# EAGLE design io_board (EAGLE 7.1.0)
Assembly variants: 3.3V monochrome, 5V monochrome, 3.3V RGB, 5V RGB

## Sheet 1 of 2
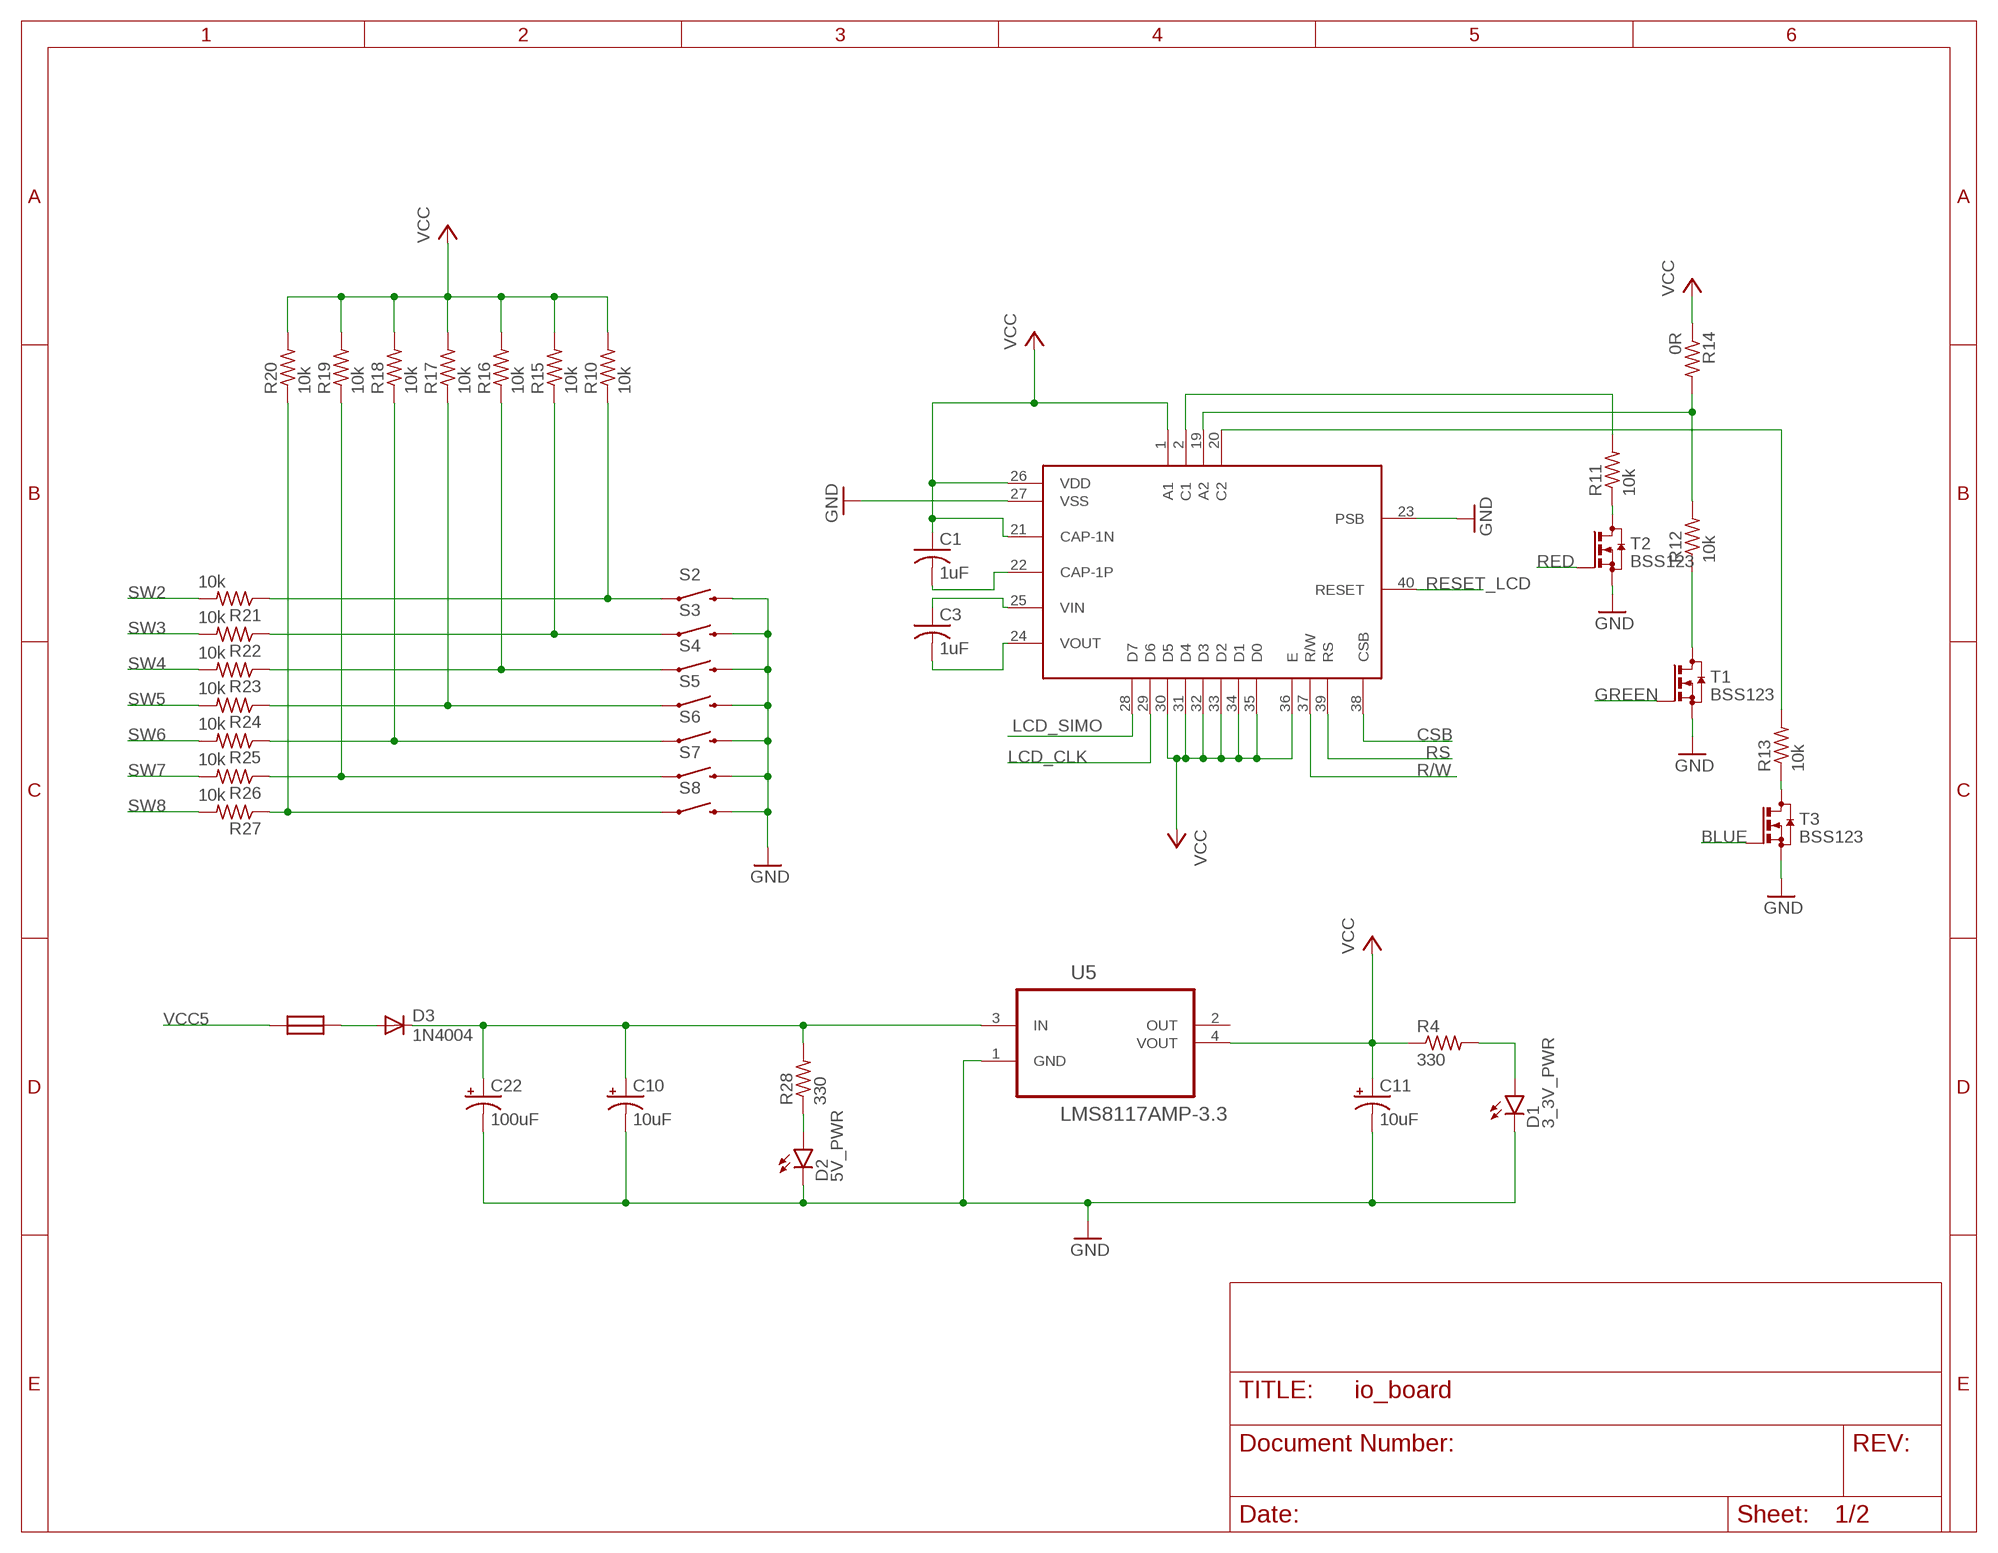
[diagram p0: schematic, sheet 1]

### Parts
C1  1uF  C-USC1206K  [C1206K]
C3  1uF  C-USC1206K  [C1206K]
C10  10uF  10UF-16V-10%(TANT)  [EIA3216]
C11  10uF  10UF-16V-10%(TANT)  [EIA3216]
C22  100uF  100UF-10V-10%(TANT)  [EIA7343]
D1  3_3V_PWR  LED-FKIT-1206  [FKIT-LED-1206]
D2  5V_PWR  LED-FKIT-1206  [FKIT-LED-1206]
D3  1N4004  [DO41-10]
R4  330  R-US_R0805W  [R0805W]
R10  10k  R-US_R1206W  [R1206W]
R11  10k  R-US_R1206W  [R1206W]
R12  10k  R-US_R1206W  [R1206W]  (not fitted in variant 3.3V monochrome)  (not fitted in variant 5V monochrome)
R13  10k  R-US_R1206W  [R1206W]
R14  0R  R-US_R1206W  [R1206W]  (not fitted in variant 3.3V RGB)  (not fitted in variant 5V RGB)
R15  10k  R-US_R1206W  [R1206W]
R16  10k  R-US_R1206W  [R1206W]
R17  10k  R-US_R1206W  [R1206W]
R18  10k  R-US_R1206W  [R1206W]
R19  10k  R-US_R1206W  [R1206W]
R20  10k  R-US_R1206W  [R1206W]
R21  10k  R-US_R1206W  [R1206W]
R22  10k  R-US_R1206W  [R1206W]
R23  10k  R-US_R1206W  [R1206W]
R24  10k  R-US_R1206W  [R1206W]
R25  10k  R-US_R1206W  [R1206W]
R26  10k  R-US_R1206W  [R1206W]
R27  10k  R-US_R1206W  [R1206W]
R28  330  R-US_R0805W  [R0805W]
S2  SWITCH-MOMENTARY-2SMD-4  [TACTILE_SWITCH_TALL]
S3  SWITCH-MOMENTARY-2SMD-4  [TACTILE_SWITCH_TALL]
S4  SWITCH-MOMENTARY-2SMD-4  [TACTILE_SWITCH_TALL]
S5  SWITCH-MOMENTARY-2SMD-4  [TACTILE_SWITCH_TALL]
S6  SWITCH-MOMENTARY-2SMD-4  [TACTILE_SWITCH_TALL]
S7  SWITCH-MOMENTARY-2SMD-4  [TACTILE_SWITCH_TALL]
S8  SWITCH-MOMENTARY-2SMD-4  [TACTILE_SWITCH_TALL]
T1  BSS123  [SOT23]
T2  BSS123  [SOT23]
T3  BSS123  [SOT23]
U5  LMS8117AMP-3.3  [SOT230P696X180-4N]
U$2  EA_DOGMXXX-A  [EADOGM]
U$3  NANO_FUSE  [NANO_FUSE]

### Nets
BLUE: T3.1(G) ; also sheet 2
CSB: U$2.38(CSB) ; also sheet 2
GND: C10.C(-) C11.C(-) C22.C(-) D1.C D2.C S2.B2 S3.B2 S4.B2 S5.B2 S6.B2 S7.B2 S8.B2 T1.2(S) T2.2(S) T3.2(S) U5.1(GND) U$2.23(PSB) U$2.27(VSS) ; also sheet 2
GREEN: T1.1(G) ; also sheet 2
LCD_CLK: U$2.29(D6) ; also sheet 2
LCD_SIMO: U$2.28(D7) ; also sheet 2
N$1: R12.2 R14.2 U$2.19(A2)
N$2: R11.1 T2.3(D)
N$3: R12.1 T1.3(D)
N$7: R13.1 T3.3(D)
N$9: R11.2 U$2.2(C1)
N$10: R13.2 U$2.20(C2)
N$11: C1.2 U$2.22(CAP-1P)
N$13: C3.1 U$2.25(VIN)
N$14: C3.2 U$2.24(VOUT)
N$16: R10.1 R21.1 S2.A2
N$17: R15.1 R22.1 S3.A2
N$18: R16.1 R23.1 S4.A2
N$19: R17.1 R24.1 S5.A2
N$20: R18.1 R25.1 S6.A2
N$21: R19.1 R26.1 S7.A2
N$22: R20.1 R27.1 S8.A2
N$23: D1.A R4.2
N$24: D2.A R28.1
N$25: D3.A U$3.2
N$27: C10.A(+) C22.A(+) D3.C R28.2 U5.3(IN)
R/W: U$2.37(R/W) ; also sheet 2
RED: T2.1(G) ; also sheet 2
RESET_LCD: U$2.40(RESET) ; also sheet 2
RS: U$2.39(RS)
SW2: R21.2 ; also sheet 2
SW3: R22.2 ; also sheet 2
SW4: R23.2 ; also sheet 2
SW5: R24.2 ; also sheet 2
SW6: R25.2 ; also sheet 2
SW7: R26.2 ; also sheet 2
SW8: R27.2 ; also sheet 2
VCC: C1.1 C11.A(+) R4.1 R10.2 R14.1 R15.2 R16.2 R17.2 R18.2 R19.2 R20.2 U5.4(VOUT) U$2.1(A1) U$2.21(CAP-1N) U$2.26(VDD) U$2.30(D5) U$2.31(D4) U$2.32(D3) U$2.33(D2) U$2.34(D1) U$2.35(D0) U$2.36(E) ; also sheet 2
VCC5: U$3.1 ; also sheet 2
Unconnected: U5.2(OUT)

## Sheet 2 of 2
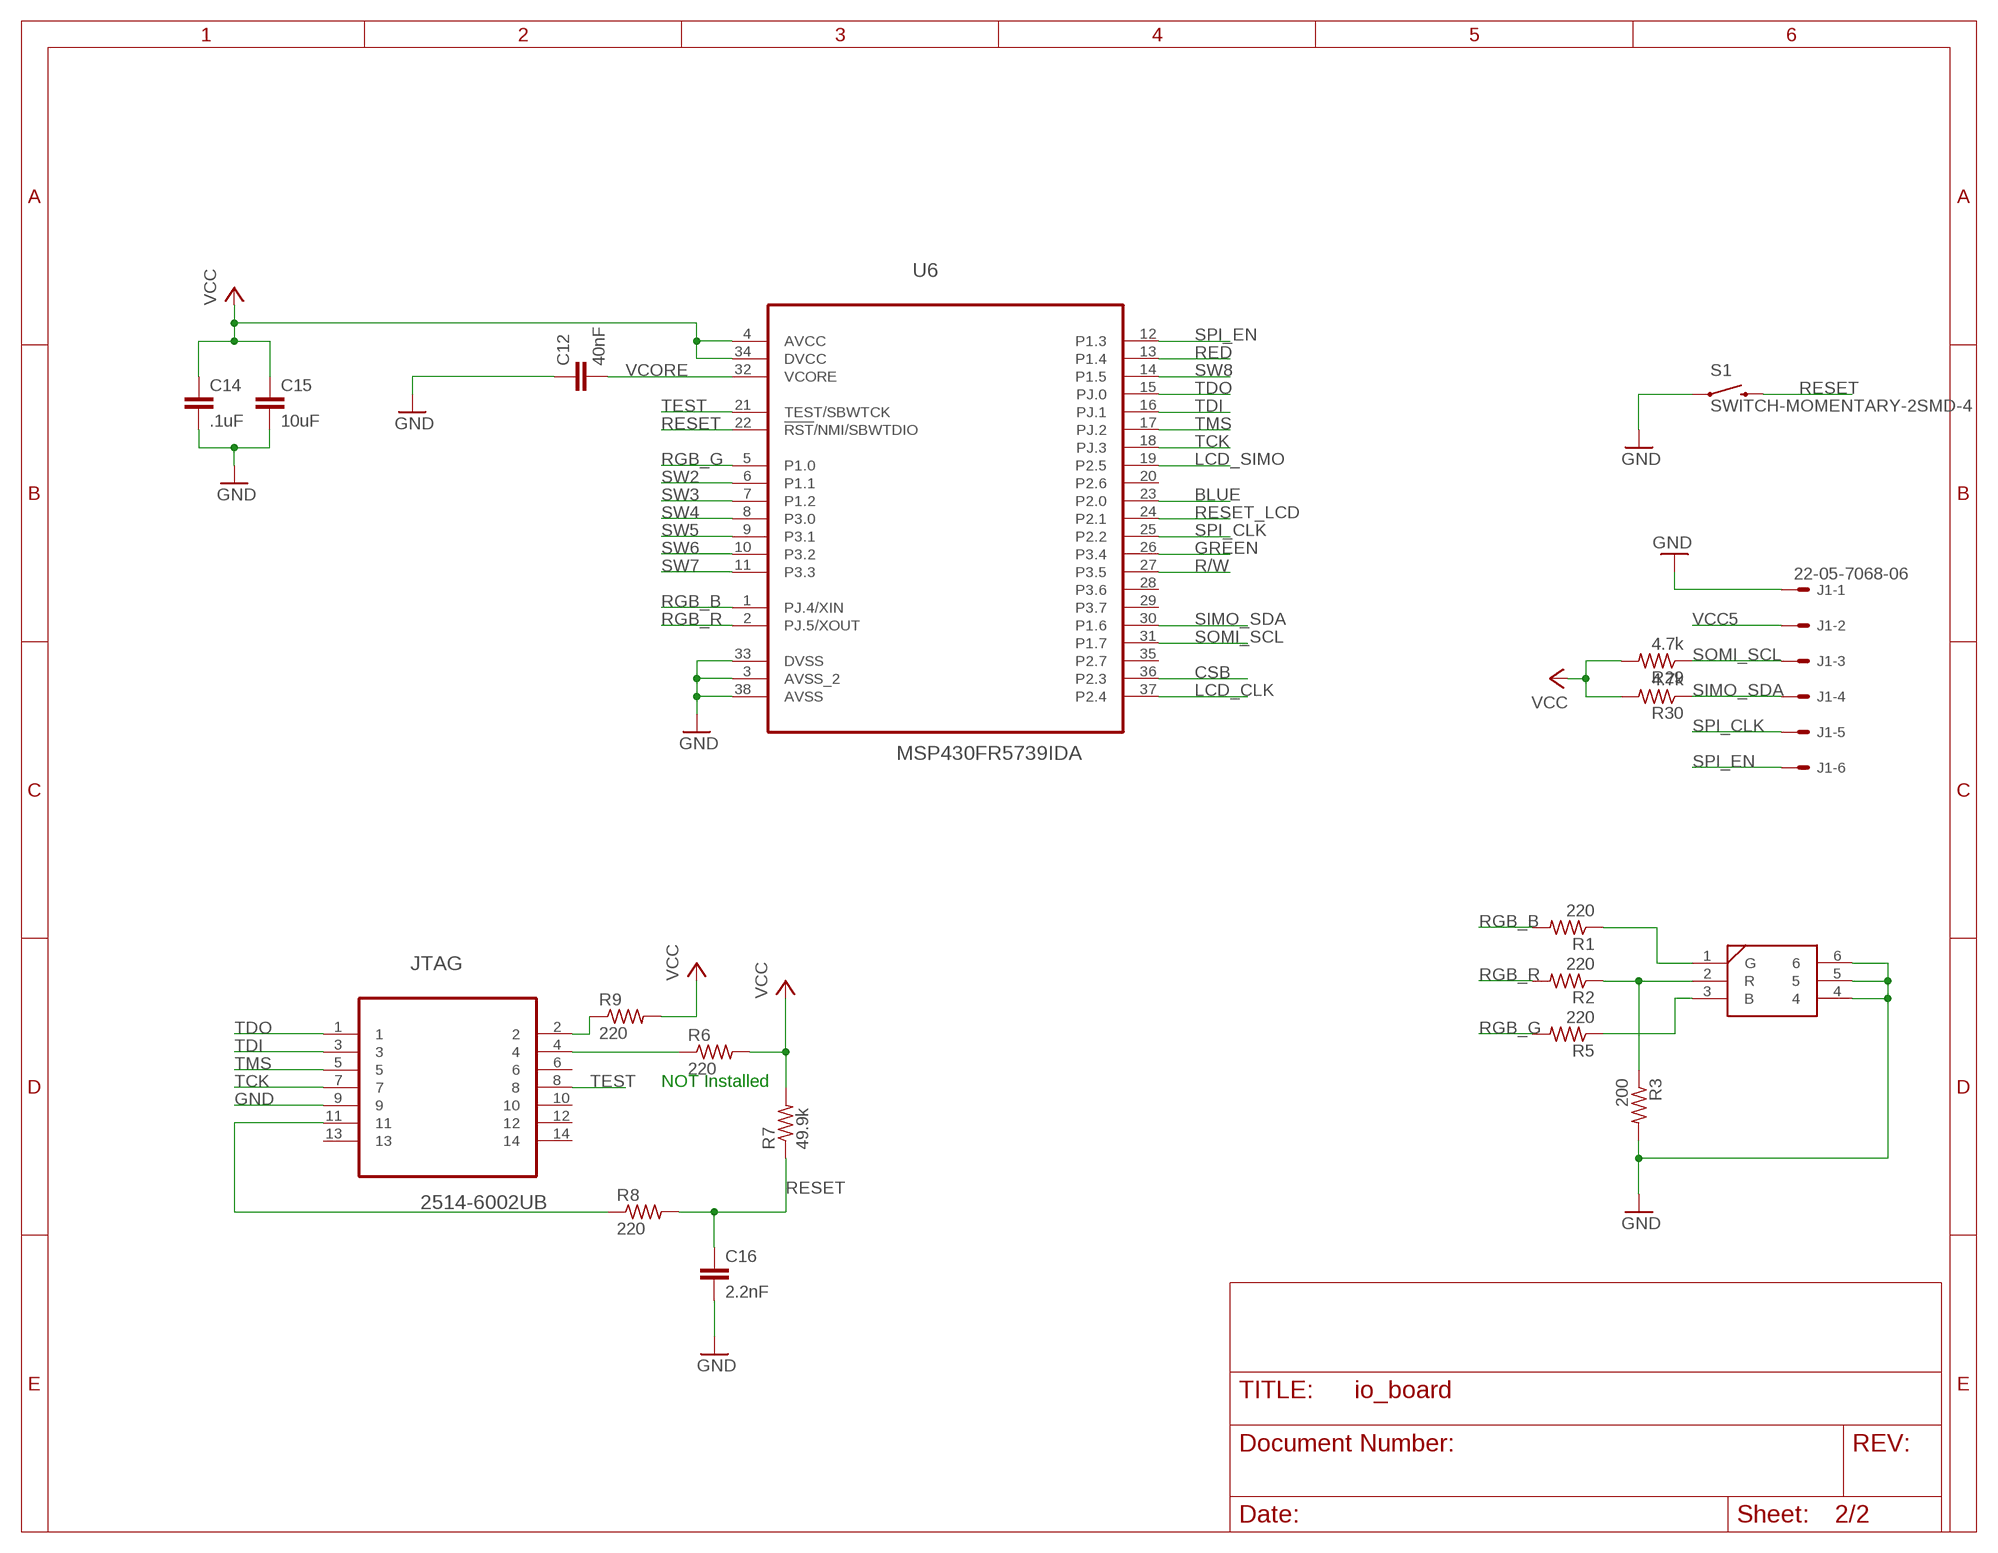
[diagram p1: schematic, sheet 2]

### Parts
C12  40nF  CAP0805  [0805]
C14  .1uF  CAP0805  [0805]
C15  10uF  CAP0805  [0805]
C16  2.2nF  CAP0805  [0805]
J1  22-05-7068-06  [7395-06]
JTAG  2514-6002UB  [3M_2514-6002UB]
R1  220  R-US_R0805W  [R0805W]
R2  220  R-US_R0805W  [R0805W]
R3  200  R-US_R0805W  [R0805W]
R5  220  R-US_R0805W  [R0805W]
R6  220  R-US_R0805W  [R0805W]
R7  49.9k  R-US_R0805W  [R0805W]
R8  220  R-US_R0805W  [R0805W]
R9  220  R-US_R0805W  [R0805W]
R29  4.7k  R-US_R0805W  [R0805W]
R30  4.7k  R-US_R0805W  [R0805W]
S1  SWITCH-MOMENTARY-2SMD-4  [TACTILE_SWITCH_TALL]
U6  MSP430FR5739IDA  [SOP65P810X120-38N]
U$7  RGB  [RGB_SMD]

### Nets
BLUE: U6.23(P2.0) ; also sheet 1
CSB: U6.36(P2.3) ; also sheet 1
GND: C12.1 C14.2 C15.2 C16.2 J1.1 JTAG.9 R3.2 S1.A2 U6.3(AVSS_2) U6.33(DVSS) U6.38(AVSS) U$7.4 U$7.5 U$7.6 ; also sheet 1
GREEN: U6.26(P3.4) ; also sheet 1
LCD_CLK: U6.37(P2.4) ; also sheet 1
LCD_SIMO: U6.19(P2.5) ; also sheet 1
N$4: JTAG.4 R6.1
N$5: JTAG.2 R9.1
N$6: R2.1 R3.1 U$7.2(R)
N$8: JTAG.11 R8.1
N$12: R5.1 U$7.3(B)
N$15: R1.1 U$7.1(G)
R/W: U6.27(P3.5) ; also sheet 1
RED: U6.13(P1.4) ; also sheet 1
RESET: C16.1 R7.1 R8.2 S1.B2 U6.22(!RST!/NMI/SBWTDIO)
RESET_LCD: U6.24(P2.1) ; also sheet 1
RGB_B: R1.2 U6.1(PJ.4/XIN)
RGB_G: R5.2 U6.5(P1.0)
RGB_R: R2.2 U6.2(PJ.5/XOUT)
SIMO_SDA: J1.4 R30.1 U6.30(P1.6)
SOMI_SCL: J1.3 R29.1 U6.31(P1.7)
SPI_CLK: J1.5 U6.25(P2.2)
SPI_EN: J1.6 U6.12(P1.3)
SW2: U6.6(P1.1) ; also sheet 1
SW3: U6.7(P1.2) ; also sheet 1
SW4: U6.8(P3.0) ; also sheet 1
SW5: U6.9(P3.1) ; also sheet 1
SW6: U6.10(P3.2) ; also sheet 1
SW7: U6.11(P3.3) ; also sheet 1
SW8: U6.14(P1.5) ; also sheet 1
TCK: JTAG.7 U6.18(PJ.3)
TDI: JTAG.3 U6.16(PJ.1)
TDO: JTAG.1 U6.15(PJ.0)
TEST: JTAG.8 U6.21(TEST/SBWTCK)
TMS: JTAG.5 U6.17(PJ.2)
VCC: C14.1 C15.1 R6.2 R7.2 R9.2 R29.2 R30.2 U6.4(AVCC) U6.34(DVCC) ; also sheet 1
VCC5: J1.2 ; also sheet 1
VCORE: C12.2 U6.32(VCORE)
Unconnected: JTAG.6 JTAG.10 JTAG.12 JTAG.13 JTAG.14 U6.20(P2.6) U6.28(P3.6) U6.29(P3.7) U6.35(P2.7)

### Notes on the sheet
- NOT Installed

## Library data of the parts
C1 C3 = rcl:C-US: CAPACITOR, American symbol
C10 C11 = SparkFun-Capacitors:10UF-16V-10%(TANT): CAP-00811 1206/EIA-3216 Tantalum capacitor; PROD_ID: CAP-00811
C12 C14-C16 = SparkFun-Capacitors:CAP: Capacitor Standard 0603 ceramic capacitor, and 0.1" leaded capacitor.
C22 = SparkFun-Capacitors:100UF-10V-10%(TANT): CAP-07890; PROD_ID: CAP-07890
D1 D2 = SparkFun-LED:LED: LEDs Standard schematic elements and footprints for 5mm, 3mm, 1206, and 0603 sized LEDs. 5mm - Spark Fun Electronics SKU : COM-00529 (and others)
D3 = diode:1N4004: DIODE general purpose rectifier, 1 A
J1 = con-molex:22-?-06: CONNECTOR wire to board 2.54 mm (.1 inch) pitch header; OC_FARNELL: unknown; OC_NEWARK: unknown
JTAG = msp_jtag:2514-6002UB: Four-Wall Header; MPN: 2514-6002UB; OC_FARNELL: 1368928; OC_NEWARK: 46F4726; PACKAGE: Four-Wall Header, 14way; SUPPLIER: 3M
R1-R30 = rcl:R-US_: RESISTOR, American symbol
S1-S8 = SparkFun-Electromechanical:SWITCH-MOMENTARY-2: Various NO switches- pushbuttons, reed, etc; PROD_ID: SWCH-11966
T1-T3 = transistor-small-signal:BSS123: N-CHANNEL MOS FET
U5 = NSC-LMS8117AMP:LMS8117AMP-3.3: Low-Dropout Linear Regulator; MPN: LMS8117AMP-3.3; OC_FARNELL: 1469032; OC_NEWARK: 41K3020; PACKAGE: SOT-223-3; SUPPLIER: National Semiconductor
U6 = TI-MSP430FR5739:MSP430FR5739IDA: Mixed Signal Microcontroller,TSSOP-38; MPN: MSP430FR5739IDA; OC_FARNELL: 2148662; OC_NEWARK: 28W4632; PACKAGE: TSSOP-38; SUPPLIER: TEXAS INSTRUMENTS
U$2 = io_board:EA_DOGMXXX-A
U$3 = custom_fuses:NANO_FUSE
U$7 = TIparts:RGB

## Net classes
0 default: width 0.203 mm, drill 0.483 mm, clearance 0.254 mm

## Board
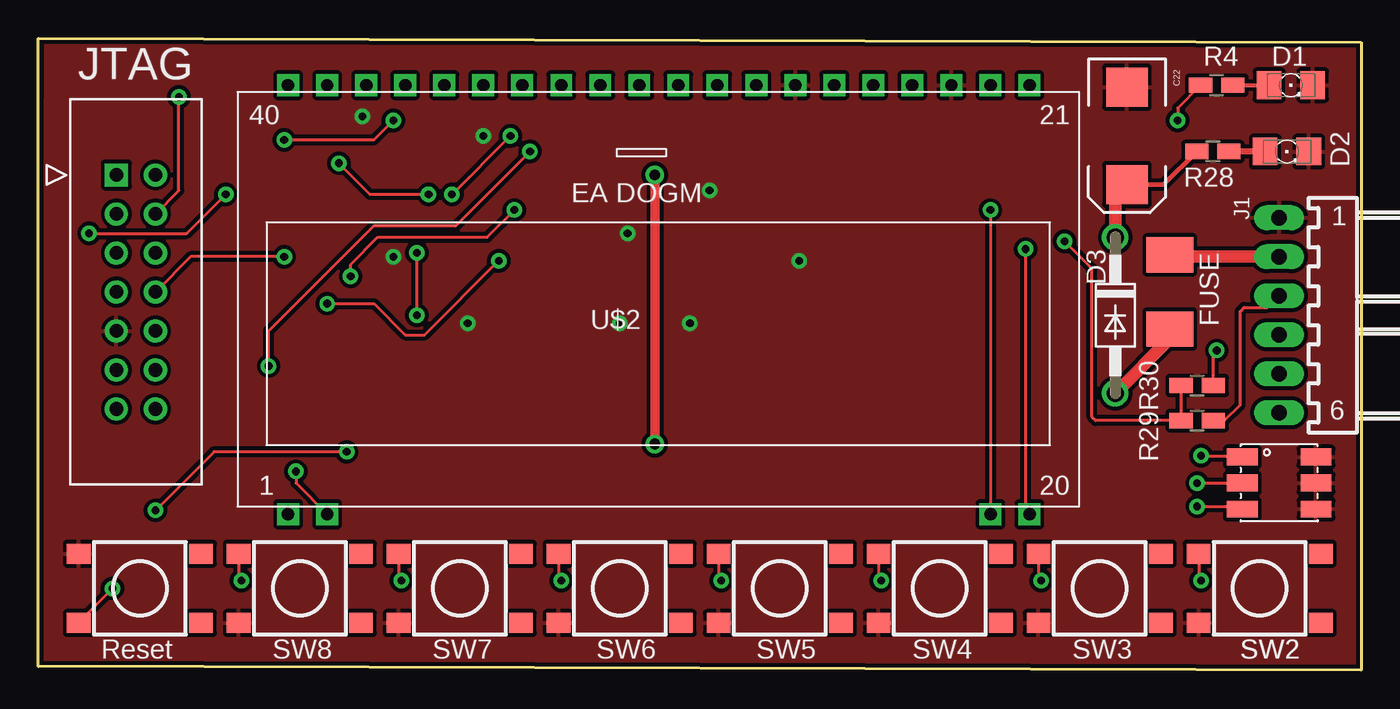
[diagram p2: board, top side]
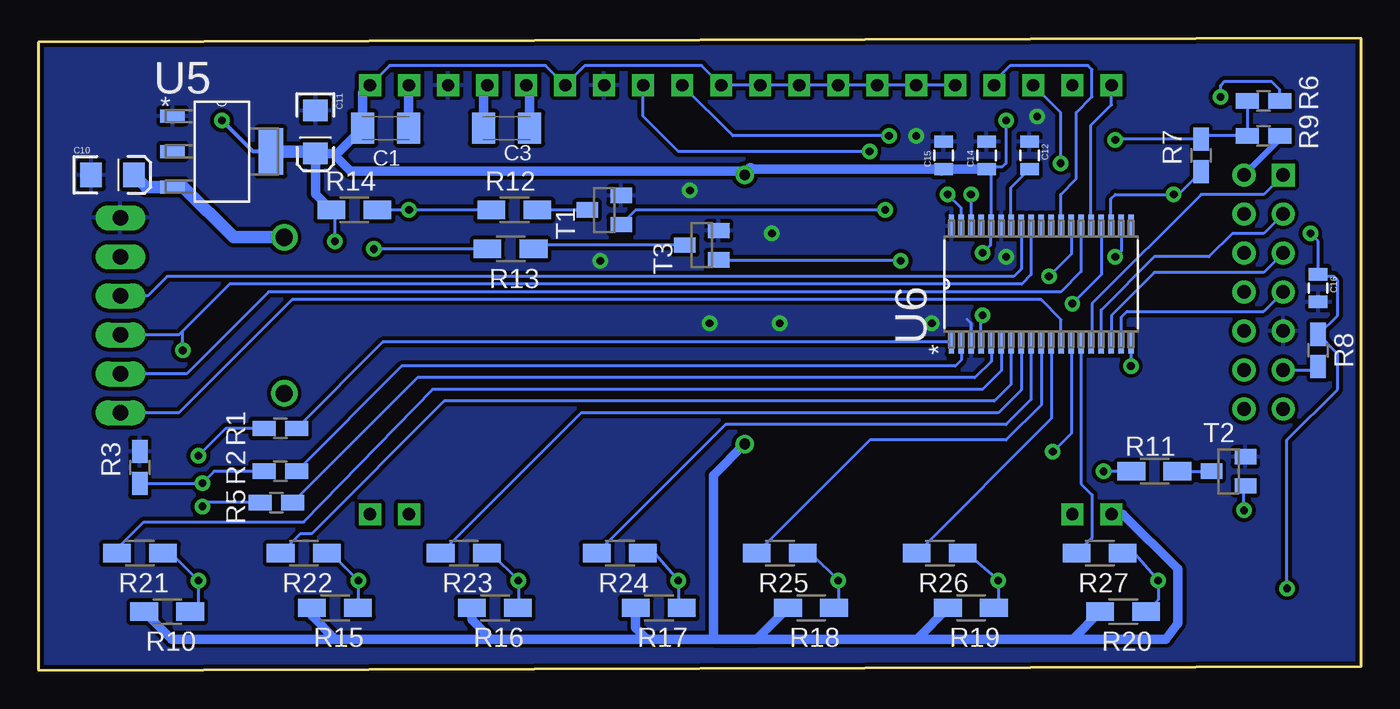
[diagram p3: board, bottom side, seen from below]

Size 86.11 x 41.15 mm. Coordinates in mm from the lower left corner, seen from the top.
Outline: 0,0.25 0,41.15 86.11,40.89 86.11,0 0,0.25
Copper layers (1*16): Top 0.035mm / dielectric 1.5mm / Bottom 0.035mm
Design rules "SparkFun *": minimum track width 8mil, minimum drill 19mil, track to track 8mil, track to pad 8mil, pad to pad 8mil, via to via 8mil, smd to smd 8mil, copper to edge 10mil, drill to drill 8mil, minimum pad ring 12mil, minimum via ring 10mil, stop-mask expansion 4mil, vias tented up to drill 25mil, thermal gap 10mil

### Footprints (pad centres in the part's own frame; a part is rotated, then mirrored left to right if it is on the bottom)
C1206K = smd 1.5 x 2: 1 -1.5,0; 2 1.5,0
EIA3216 = smd 1.4 x 1.6: A 1.4,0; C -1.4,0
0805 = smd 0.8 x 1.2: 1 -0.9,0; 2 0.9,0
EIA7343 = smd 2.55 x 2.7: A 3.17,0; C -3.17,0
FKIT-LED-1206 = smd 1.6 x 1.803: A -1.422,0; C 1.422,0
DO41-10 = drill 1.118: A 5.08,0; C -5.08,0
7395-06 = drill 1.016 long: 1 6.35,0; 2 3.81,0; 3 1.27,0; 4 -1.27,0; 5 -3.81,0; 6 -6.35,0
3M_2514-6002UB = drill 0.889 square: 1 0,2.54 | drill 0.889: 2 0,0; 3 -2.54,2.54; 4 -2.54,0; 5 -5.08,2.54; 6 -5.08,0; 7 -7.62,2.54; 8 -7.62,0; 9 -10.16,2.54; 10 -10.16,0; 11 -12.7,2.54; 12 -12.7,0; 13 -15.24,2.54; 14 -15.24,0
R0805W = smd 1.5 x 1: 1 -1.052,0; 2 1.052,0
R1206W = smd 1.8 x 1.2: 1 -1.499,0; 2 1.499,0
TACTILE_SWITCH_TALL = smd 1.55 x 1.3: A1 -3.975,-2.25; A2 3.975,-2.25; B1 -3.975,2.25; B2 3.975,2.25
SOT23 = smd 1 x 1.4: 1 -0.95,-1.1; 2 0.95,-1.1; 3 0,1.1
SOT230P696X180-4N = smd 1.6 x 0.838: 1 -3.2,2.311; 2 -3.2,0; 3 -3.2,-2.311 | smd 1.6 x 3.023: 4 3.2,0
SOP65P810X120-38N = smd 1.473 x 0.356: 1 -3.785,5.842; 2 -3.785,5.207; 3 -3.785,4.547; 4 -3.785,3.912; 5 -3.785,3.251; 6 -3.785,2.591; 7 -3.785,1.956; 8 -3.785,1.295; 9 -3.785,0.66; 10 -3.785,0; 11 -3.785,-0.66; 12 -3.785,-1.295; 13 -3.785,-1.956; 14 -3.785,-2.591; 15 -3.785,-3.251; 16 -3.785,-3.912; 17 -3.785,-4.547; 18 -3.785,-5.207; 19 -3.785,-5.842; 20 3.785,-5.842; 21 3.785,-5.207; 22 3.785,-4.547; 23 3.785,-3.912; 24 3.785,-3.251; 25 3.785,-2.591; 26 3.785,-1.956; 27 3.785,-1.295; 28 3.785,-0.66; 29 3.785,0; 30 3.785,0.66; 31 3.785,1.295; 32 3.785,1.956; 33 3.785,2.591; 34 3.785,3.251; 35 3.785,3.912; 36 3.785,4.547; 37 3.785,5.207; 38 3.785,5.842
EADOGM = drill 0.813 square: 1 -21.59,-13.97; 2 -19.05,-13.97; 19 24.13,-13.97; 20 26.67,-13.97; 21 26.67,13.97; 22 24.13,13.97; 23 21.59,13.97; 24 19.05,13.97; 25 16.51,13.97; 26 13.97,13.97; 27 11.43,13.97; 28 8.89,13.97; 29 6.35,13.97; 30 3.81,13.97; 31 1.27,13.97; 32 -1.27,13.97; 33 -3.81,13.97; 34 -6.35,13.97; 35 -8.89,13.97; 36 -11.43,13.97; 37 -13.97,13.97; 38 -16.51,13.97; 39 -19.05,13.97; 40 -21.59,13.97
NANO_FUSE = smd 2.286 x 3.048: 1 -2.413,0; 2 2.413,0
RGB_SMD = smd 2 x 1.1: 1 2.4,-1.7; 2 2.4,0; 3 2.4,1.7; 4 -2.4,1.7; 5 -2.4,0; 6 -2.4,-1.7

### Placement (x,y rotation side)
C1  63.5,35.31 0 bottom
C3  55.63,35.31 180 bottom
C10  81.28,32.26 0 bottom
C11  68.07,35.05 270 bottom
C12  21.59,33.53 270 bottom
C14  24.38,33.53 90 bottom
C15  27.18,33.53 90 bottom
C16  2.79,24.89 270 bottom
C22  70.87,34.8 270 top
D1  81.53,38.1 0 top
D2  81.28,33.78 0 top
D3  70.1,23.11 270 top
J1  80.77,23.11 90 top
JTAG  7.62,32.26 90 top
R1  70.36,15.75 0 bottom
R2  70.36,12.95 0 bottom
R3  79.5,13.21 90 bottom
R4  76.71,38.1 0 top
R5  70.61,10.92 0 bottom
R6  6.35,37.08 180 bottom
R7  10.41,33.53 90 bottom
R8  2.79,20.83 90 bottom
R9  6.35,34.8 180 bottom
R10  77.72,3.81 180 bottom
R11  13.46,12.95 180 bottom
R12  55.12,29.97 180 bottom
R13  55.37,27.43 180 bottom
R14  65.53,29.97 0 bottom
R15  66.8,4.06 180 bottom
R16  56.39,4.06 180 bottom
R17  45.72,4.06 180 bottom
R18  35.81,4.06 180 bottom
R19  25.4,4.06 180 bottom
R20  15.49,3.81 180 bottom
R21  79.5,7.62 180 bottom
R22  68.83,7.62 180 bottom
R23  58.42,7.62 180 bottom
R24  48.26,7.62 180 bottom
R25  37.85,7.62 180 bottom
R26  27.43,7.62 180 bottom
R27  17.02,7.62 180 bottom
R28  76.45,33.78 180 top
R29  75.44,16.26 180 top
R30  75.44,18.54 180 top
S1  6.6,5.33 180 top
S2  79.5,5.33 180 top
S3  69.09,5.33 180 top
S4  58.67,5.33 180 top
S5  48.26,5.33 180 top
S6  37.85,5.33 180 top
S7  27.43,5.33 180 top
S8  17.02,5.33 180 top
T1  49.28,29.97 90 bottom
T2  8.64,12.95 90 bottom
T3  42.93,27.69 90 bottom
U5  74.17,33.78 0 bottom
U6  20.83,25.15 90 bottom
U$2  37.85,24.13 0 top
U$3  73.66,24.64 270 top
U$7  80.77,12.19 180 top

### Tracks (layer width: path | path; a pad name or v marks a point on that pad's centre or on a via)
BLUE  (via drill 0.5)
  Top 0.203: v18.8,23.88 21.84,23.88 23.88,21.84 25.15,21.84 v29.97,26.67
  Bottom 0.203: U6.23 16.92,25.76 v18.8,23.88 | v29.97,26.67 41.76,26.67 T3.1
CSB  (via drill 0.5)
  Top 0.203: v25.4,30.99 21.59,30.99 v19.56,33.02
  Bottom 0.203: U6.36 25.38,30.96 v25.4,30.99 | v19.56,33.02 19.56,36.32 U$2.38
GND  (via drill 0.5)
  Bottom 0.203: U6.3 25.38,22.58 25.65,22.86
  other vias: 23.11,26.92 27.94,22.61 42.42,22.61 37.85,22.61 38.35,28.45 49.53,26.67 43.69,31.24 28.96,34.8 21.08,36.07
  pour Top (isolate 0.254): 0.51,46.74 94.23,46.74 94.23,-3.3 0.25,-3.56
  pour Bottom (isolate 0.254): 0,40.89 86.11,40.89 86.11,0 0,0
GREEN  (via drill 0.5)
  Top 0.203: v20.32,25.65 20.32,26.42 22.1,28.19 29.21,28.19 v30.99,29.97
  Bottom 0.203: U6.26 18.87,27.1 v20.32,25.65 | v30.99,29.97 47.23,29.97 T1.1
LCD_CLK  (via drill 0.5)
  Top 0.203: v26.92,30.99 v30.73,34.8
  Bottom 0.203: U6.37 26.04,30.1 v26.92,30.99 | v30.73,34.8 40.89,34.8 U$2.29
LCD_SIMO  (via drill 0.5)
  Top 0.203: v14.99,19.81 14.99,22.1 21.84,28.96 27.18,28.96 v32,33.78
  Bottom 0.203: U6.19 v14.99,19.81 | v32,33.78 44.45,33.78 46.74,36.07 U$2.28
N$1  (via drill 0.5)
  Top 0.203: v61.98,29.97 U$2.19
  Bottom 0.203: R12.2 v61.98,29.97 R14.2
N$2
  Bottom 0.203: R11.1 T2.3
N$3
  Bottom 0.203: T1.3 R12.1
N$4  (via drill 0.5)
  Top 0.203: JTAG.4 9.14,31.24 v9.14,37.34
  Bottom 0.203: v9.14,37.34 9.14,38.1 8.89,38.35 5.84,38.35 5.33,37.85 5.33,37.12 R6.1
N$5
  Bottom 0.406: R9.1 5.3,34.58 JTAG.2
N$6  (via drill 0.5)
  Top 0.203: v75.44,12.19 U$7.2
  Bottom 0.203: R2.1 74.68,12.95 v75.44,12.19 75.48,12.16 R3.1
N$7
  Bottom 0.203: T3.3 53.62,27.69 R13.1
N$8
  Bottom 0.203: JTAG.11 3.01,19.56 R8.1
N$9  (via drill 0.5)
  Top 0.203: v16.76,12.95 16.76,12.19 U$2.2
  Bottom 0.203: R11.2 v16.76,12.95
N$10  (via drill 0.5)
  Top 0.203: v64.26,27.43 64.26,10.41 U$2.20
  Bottom 0.203: R13.2 v64.26,27.43
N$11
  Bottom 0.61: C1.2 62,38.08 U$2.22
N$12  (via drill 0.5)
  Top 0.203: v75.44,10.67 78.2,10.67 U$7.3
  Bottom 0.203: R5.1 75.18,10.92 v75.44,10.67
N$13
  Bottom 0.61: C3.1 54.13,37.87 U$2.25
N$14
  Bottom 0.61: C3.2 57.13,37.87 U$2.24
N$15  (via drill 0.5)
  Top 0.203: v75.69,13.97 78.29,13.97 U$7.1
  Bottom 0.203: R1.1 73.91,15.75 v75.69,13.97
N$16  (via drill 0.5)
  Top 0.203: S2.A2 75.53,6.01 v75.69,5.84
  Bottom 0.203: R10.1 75.69,4.34 v75.69,5.84 77.47,7.62 R21.1
N$17  (via drill 0.5)
  Top 0.203: S3.A2 65.11,6.01 v65.28,5.84
  Bottom 0.203: R15.1 65.28,4.09 v65.28,5.84 67.06,7.62 R22.1
N$18  (via drill 0.5)
  Top 0.203: S4.A2 54.7,6.01 v54.86,5.84
  Bottom 0.203: R16.1 54.86,4.09 v54.86,5.84 56.64,7.62 R23.1
N$19  (via drill 0.5)
  Top 0.203: S5.A2 44.28,6.01 v44.45,5.84
  Bottom 0.203: R17.1 44.45,4.6 v44.45,5.84 45.97,7.62 R24.1
N$20  (via drill 0.5)
  Top 0.203: S6.A2 33.87,6.01 v34.04,5.84
  Bottom 0.203: R18.1 34.04,4.34 v34.04,5.84 35.81,7.62 R25.1
N$21  (via drill 0.5)
  Top 0.203: S7.A2 23.46,6.01 v23.62,5.84
  Bottom 0.203: R19.1 23.62,4.34 v23.62,5.84 25.65,7.62 R26.1
N$22  (via drill 0.5)
  Top 0.203: S8.A2 13.04,6.01 v13.21,5.84
  Bottom 0.203: R20.1 13.21,4.6 v13.21,5.84 14.73,7.62 R27.1
N$23
  Top 0.254: R4.2 D1.A
N$24
  Top 0.406: D2.A R28.1
N$25
  Top 0.813: U$3.2 73.66,21.59 D3.A
N$27
  Top 0.305: C22.A 73.25,31.63 R28.2
  Top 0.813: D3.C 70.1,30.87 C22.A
  Bottom 0.61: U5.3 76.68,31.47
  Bottom 0.813: 76.68,31.47 73.41,28.19 D3.C | C10.A 79.09,31.47 U5.3
R/W
  Bottom 0.203: U$2.37 23.88,38.35 22.86,39.37 17.78,39.37 17.53,39.12 17.53,37.34 18.54,36.32 18.54,32 19.56,30.99 19.56,28.96 U6.27
RED  (via drill 0.5)
  Top 0.203: v20.07,14.22 11.43,14.22 v7.62,10.41
  Bottom 0.203: U6.13 18.87,15.42 v20.07,14.22 | v7.62,10.41 7.62,11.92 T2.1
RESET  (via drill 0.5)
  Top 0.203: v3.3,28.45 9.65,28.45 v12.19,30.99 | S1.B2 2.63,3.14 v4.83,5.33
  Bottom 0.203: v3.3,28.45 2.79,27.94 C16.1 2.66,25.65 1.78,25.65 1.52,25.4 1.52,23.11 2.76,21.88 R8.2 1.52,20.61 1.52,18.29 4.83,14.99 v4.83,5.33 | R7.1 11.9,30.99 v12.19,30.99 16,30.99 16.28,30.71 U6.22
RESET_LCD
  Bottom 0.203: U6.24 17.58,35.51 16.26,36.83 U$2.40
RGB_B
  Bottom 0.203: U6.1 63.69,21.36 R1.2
RGB_G
  Bottom 0.203: U6.5 24.08,20.12 25.15,19.05 61.43,19.05 R5.2
RGB_R
  Bottom 0.203: U6.2 26.04,20.19 26.42,19.81 62.45,19.81 R2.2
SIMO_SDA  (via drill 0.5)
  Top 0.203: R30.1 76.49,20.61 v76.71,20.83
  Bottom 0.203: U6.30 21.49,25.76 22.1,25.15 73.66,25.15 76.58,22.22 76.71,22.1 | 76.71,22.1 76.96,21.84 J1.4 | v76.71,20.83 76.71,22.1
SOMI_SCL
  Top 0.203: R29.1 77.22,16.26 78.23,17.27 78.23,23.37 78.49,23.62 80.01,23.62 J1.3
  Bottom 0.203: U6.31 22.12,26.14 22.61,25.65 77.72,25.65 78.99,24.38 J1.3
SPI_CLK
  Bottom 0.203: U6.25 18.24,25.96 19.56,24.64 71.12,24.64 76.45,19.3 J1.5
SPI_EN
  Bottom 0.203: U6.12 19.53,22.84 20.83,24.13 69.6,24.13 76.96,16.76 J1.6
SW2
  Bottom 0.203: R21.2 81,7.9 79.25,9.65 68.83,9.65 60.45,18.29 24.64,18.29 23.42,19.51 U6.6
SW3
  Bottom 0.203: U6.7 22.78,18.62 23.88,17.53 59.69,17.53 68.33,8.89 69.06,8.89 R22.2
SW4
  Bottom 0.203: U6.8 22.12,18.26 23.62,16.76 50.77,16.76 R23.2
SW5
  Bottom 0.203: U6.9 21.49,17.63 23.11,16 41.38,16 R24.2
SW6
  Bottom 0.203: U6.10 20.83,17.27 23.11,14.99 31.98,14.99 R25.2
SW7
  Bottom 0.203: U6.11 20.17,16.38 R26.2
SW8
  Bottom 0.203: U6.14 18.24,12.14 17.53,11.43 17.53,8.61 R27.2
TCK
  Bottom 0.203: JTAG.7 6.35,23.37 15.24,23.37 15.62,22.99 U6.18
TDI
  Bottom 0.203: JTAG.3 6.35,28.45 8.38,28.45 9.91,26.92 13.46,26.92 16.92,23.47 U6.16
TDO
  Bottom 0.203: JTAG.1 6.35,30.99 10.41,30.99 17.53,23.88 17.53,21.41 U6.15
TEST  (via drill 0.5)
  Top 0.203: v16,26.92 9.91,26.92 JTAG.8
  Bottom 0.203: U6.21 15.62,27.3 v16,26.92
TMS
  Bottom 0.203: JTAG.5 6.35,25.91 13.46,25.91 16.26,23.11 16.26,21.39 U6.17
VCC  (via drill 0.5, 0.7)
  Top 0.203: v24.64,23.11 v24.64,27.18 | v16,34.54 21.84,34.54 v23.11,35.81 | R4.1 74.17,36.61 v74.17,35.81 | R30.2 R29.2 68.83,16.26 68.58,16.51 68.58,26.16 v66.8,27.94
  Top 0.61: v40.13,32.26 v40.13,14.73
  Bottom 0.203: R6.2 R9.2 10.2,34.8 R7.2 15.96,34.58 v16,34.54 | U$2.36 U$2.35 U$2.34 U$2.33 U$2.32 U$2.31 U$2.30 42.93,39.37 50.55,39.37 U$2.26 53.09,39.37 63.25,39.37 U$2.21 | U6.4 24.74,22.76 v24.64,23.11 | v23.11,35.81 23.11,33.02 23.37,32.77 24.25,32.77 C14.1 24.08,32.32 U6.34 24.13,28.88 24.13,27.69 v24.64,27.18 | v66.8,27.94 66.8,29.74 R14.1
  Bottom 0.254: U5.4 72.14,33.78 v74.17,35.81
  Bottom 0.61: U$2.21 65,37.62 C1.1 66.65,33.65 66.93,33.65 | 27.29,32.51 C15.1 | 66.93,33.65 C11.A 68.07,31.01 R14.1 | 66.93,33.65 65.79,32.51 40.39,32.51 v40.13,32.26 | 42.16,2.03 42.16,12.7 v40.13,14.73 | 42.16,2.03 39.34,2.03 | 39.34,2.03 R18.2 | 42.16,2.03 46.48,2.03 | 46.48,2.03 56.64,2.03 | 56.64,2.03 66.8,2.03 | 66.8,2.03 77.45,2.03 R10.2 | R15.2 68.3,3.53 66.8,2.03 | R16.2 57.89,3.28 56.64,2.03 | R17.2 47.22,2.77 46.48,2.03 | R20.2 18.77,2.03 | 18.77,2.03 28.93,2.03 | 28.93,2.03 39.34,2.03 | R19.2 28.93,2.03 | U$2.1 15.49,10.16 11.94,6.6 11.94,3.05 12.7,2.03 18.77,2.03 | C15.1 39.76,32.63 | C15.1 C14.1
  Bottom 0.813: U5.4 68.2,33.78 C11.A | 39.76,32.63 v40.13,32.26
VCC5
  Top 0.813: J1.2 73.79,26.92 U$3.1
VCORE
  Bottom 0.203: U6.32 22.78,31.43 C12.2

### Text on the board
tNames: Reset | SW8 | SW7 | SW6 | SW5 | SW4 | SW3 | SW2 | SW2